# Altium schematic sheet 24V_Power_Supply.SchDoc: STM32F412 CNC
size B; Author: AM; CompanyName: Expatria Technologies; DrawnBy: A.Marles; Engineer: AM; Organization: Expatria Technolgoies; Address1: PO Box 2084; Address3: Merritt, BC V1K 1B8; Address4: Canada; DocumentNumber: 20; SheetNumber: 21; SheetTotal: 27
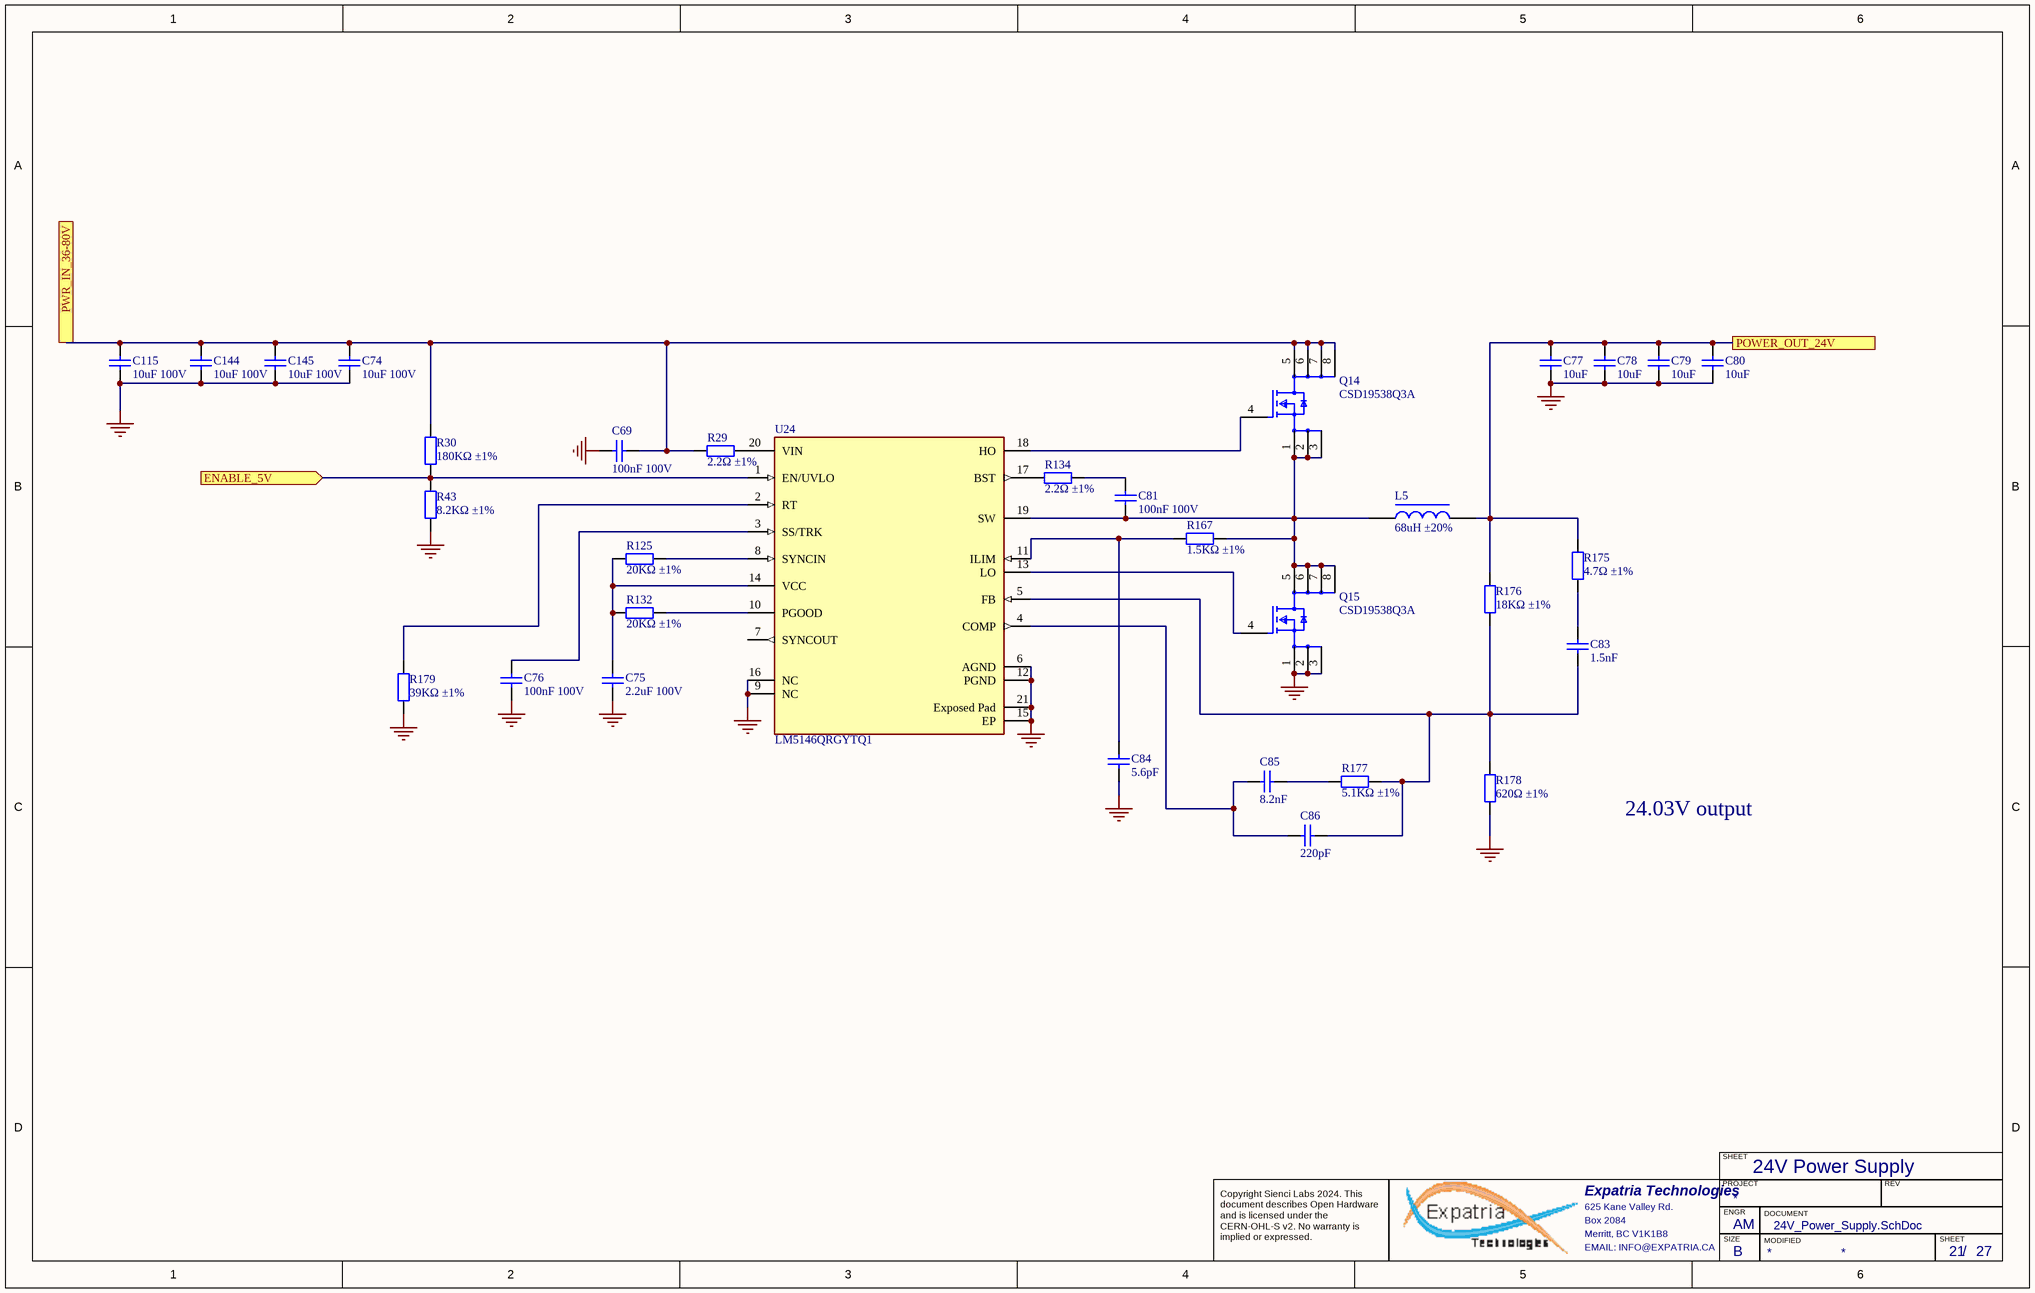
[diagram p0: 24V_Power_Supply.SchDoc]

## Parts
C69  100nF 100V  [0805_C]
C74  10uF 100V  [1210_C]
C75  2.2uF 100V  [1206_C]
C76  100nF 100V  [0805_C]
C77  10uF  [1206_C]
C78  10uF  [1206_C]
C79  10uF  [1206_C]
C80  10uF  [1206_C]
C81  100nF 100V  [0805_C]
C83  1.5nF  [0603_C]
C84  5.6pF  [0603_C]
C85  8.2nF  [0603_C]
C86  220pF  [0603_C]
C115  10uF 100V  [1210_C]
C144  10uF 100V  [1210_C]
C145  10uF 100V  [1210_C]
L5  68uH ±20%  [INDP126126X68N]
Q14  CSD19538Q3A  [FP-DNH0008A-MFG]
Q15  CSD19538Q3A  [FP-DNH0008A-MFG]
R29  2.2Ω ±1%  [0603_R]
R30  180KΩ ±1%  [0603_R]
R43  8.2KΩ ±1%  [0603_R]
R125  20KΩ ±1%  [0603_R]
R132  20KΩ ±1%  [0603_R]
R134  2.2Ω ±1%  [0603_R]
R167  1.5KΩ ±1%  [0603_R]
R175  4.7Ω ±1%  [0603_R]
R176  18KΩ ±1%  [0603_R]
R177  5.1KΩ ±1%  [0603_R]
R178  620Ω ±1%  [0603_R]
R179  39KΩ ±1%  [0603_R]
U24  LM5146QRGYTQ1  [FP-RGY0020B-MFG]

## Ports
ENABLE_5V (in), POWER_OUT_24V, PWR_IN_36-80V

## Nets
GND: C69.1 C74.1 C75.1 C76.1 C77.1 C78.1 C79.1 C80.1 C84.1 C115.1 C144.1 C145.1 Q15.1(S) Q15.2(S) Q15.3(S) R43.1 R178.1 R179.1 U24.6(AGND) U24.9(NC) U24.12(PGND) U24.15(EP) U24.16(NC) U24.21(Exposed_Pad)
ENABLE_5V: R30.1 R43.2 U24.1(EN/UVLO) ; port ENABLE_5V
POWER_OUT_24V: C77.2 C78.2 C79.2 C80.2 L5.2 R175.1 R176.2 ; port POWER_OUT_24V
PWR_IN_36-80V: C69.2 C74.2 C115.2 C144.2 C145.2 Q14.5(D) Q14.6(D) Q14.7(D) Q14.8(D) R29.1 R30.2 ; port PWR_IN_36-80V
NetC75_2: C75.2 R125.1 R132.1 U24.14(VCC)
NetC76_2: C76.2 U24.3(SS/TRK)
NetC81_1: C81.1 L5.1 Q14.1(S) Q14.2(S) Q14.3(S) Q15.5(D) Q15.6(D) Q15.7(D) Q15.8(D) R167.2 U24.19(SW)
NetC81_2: C81.2 R134.2
NetC83_1: C83.1 C86.2 R176.1 R177.2 R178.2 U24.5(FB)
NetC83_2: C83.2 R175.2
NetC84_2: C84.2 R167.1 U24.11(ILIM)
NetC85_1: C85.1 C86.1 U24.4(COMP)
NetC85_2: C85.2 R177.1
NetQ14_4: Q14.4(G) U24.18(HO)
NetQ15_4: Q15.4(G) U24.13(LO)
NetR29_2: R29.2 U24.20(VIN)
NetR125_2: R125.2 U24.8(SYNCIN)
NetR132_2: R132.2 U24.10(PGOOD)
NetR134_1: R134.1 U24.17(BST)
NetR179_2: R179.2 U24.2(RT)

Not connected (* = marked no-connect by the designer): U24 7(SYNCOUT)

## Notes on the sheet
- 24.03V output
- 24V Power Supply
- SHEET
- Expatria Technologies
- 625 Kane Valley Rd.
- Box 2084
- Merritt, BC V1K1B8
- PROJECT
- SIZE
- ENGR
- MODIFIED
- DOCUMENT
- REV
- Copyright Sienci Labs 2024. This document describes Open Hardware and is licensed under the CERN-OHL-S v2. No warranty is implied or expressed.
- EMAIL: INFO@EXPATRIA.CA
- B
- /

## Library data of the parts
C69 C76 C81 = 0805 100nF (683) 10% 100V: Chip capacitors; Manufacturer: Guangdong Fenghua Advanced Tech; Manufacturer Part Number: 0805B104K101NT; Tolerance: 10%; ComponentLink1Description: Supplier link; ComponentLink1URL: http://www.szlcsc.com/product/details_2108.html; Package: 0805; Supplier: LC; SuppliersPartNumber: C89258; Capacitance: 100nF; Voltage: 100V
C74 C115 C144 C145 = 1210 10uF (106) 10% 100V: Chip capacitors; Manufacturer: Murata; Manufacturer Part Number: GRM32EC72A106KE05L; Tolerance: 10%; Package: 1210; Supplier: LC; SuppliersPartNumber: C576517; Capacitance: 10uF; Voltage: 100V
C75 = 1206 2.2uF (225) 10% 50V: Chip capacitors; Manufacturer: Samsung Electro-Mechanics; Manufacturer Part Number: CL31A225KBHNNNE; Tolerance: 10%; ComponentLink1Description: Supplier link; ComponentLink1URL: http://www.szlcsc.com/product/details_13292.html; Package: 1206; Supplier: LC; SuppliersPartNumber: C170101; Capacitance: 2.2uF; Voltage: 100V
C77-C80 = 1206 10uF (106) 10% 50V: 50V 10uF X5R ±10% 1206 Multilayer Ceramic Capacitors MLCC - SMD/SMT ROHS; Manufacturer: Samsung Electro-Mechanics; Manufacturer Part Number: CL31A106KBHNNNE; Package: 1206; Supplier: LC; SuppliersPartNumber: C13585; Capacitance: 10uF; Tolerance: 10%; Voltage: 50V
C83 = 0603 1.5nF (152) 10% 50V: Chip capacitors; Manufacturer: Guangdong Fenghua Advanced Tech; Manufacturer Part Number: 0603B152K500NT; Tolerance: 10%; Voltage: 50V; ComponentLink1Description: Supplier link; ComponentLink1URL: http://www.szlcsc.com/product/details_1947.html; Package: 0603; Supplier: LC; SuppliersPartNumber: C1595; Capacitance: 1.5nF
C84 = 0603 4.7pF (4R7) 0.25pF 50V: Chip capacitors; Manufacturer: Murata; Manufacturer Part Number: GQM1875C2E5R6BB12D; Tolerance: 0.25pF; Voltage: 250V; ComponentLink1Description: Supplier link; ComponentLink1URL: http://www.szlcsc.com/product/details_2021.html; Package: 0603; Supplier: LC; SuppliersPartNumber: C2297617; Capacitance: 5.6pF
C85 = 0603 8.2nF (822) 10% 50V: 50V 8.2nF X7R ±10% 0603 Multilayer Ceramic Capacitors MLCC - SMD/SMT ROHS; Manufacturer: YAGEO; Manufacturer Part Number 1: CC0603KRX7R9BB822; Package: 0603; Supplier: LC; SuppliersPartNumber: C113812; Capacitance: 8.2nF; Tolerance: 10%; Voltage: 50V; Manufacturer 1: YAGEO; Value: 8.2nF; Manufacturer Part Number: CC0603KRX7R9BB822
C86 = 0603 220pF (221) 10% 50V: Chip capacitors; Manufacturer: Samsung Electro-Mechanics; Manufacturer Part Number: CL10B221KB8NNNC; Tolerance: 10%; Voltage: 50V; ComponentLink1Description: Supplier link; ComponentLink1URL: http://www.szlcsc.com/product/details_1955.html; Package: 0603; Supplier: LC; SuppliersPartNumber: C1603; Capacitance: 220pF
L5 = 12.5x12.5x6.5 68uH 20% 3A: 3A 68uH ±20% 64.8mΩ SMD Inductors (SMD) ROHS; Manufacturer: hanxia; Manufacturer Part Number: HX CYH125-68UH; Package: SMD,12.5x12.5mm; Supplier: LC; SuppliersPartNumber: C7587712; Value: 68uH ±20%
Q14 Q15 = CSD19538Q3A: CSD19538Q3A 100-V, N channel NexFET™ power MOSFET, single SON 3 mm x 3 mm, 61 mOhm 8-VSONP -55 to 150; Manufacturer Lifecycle Status: ACTIVE; NexarPartId: 74208282; Manufacturer: Texas Instruments; Drain to Source Voltage (Vdss): 100V; Number of Channels: 1; Power Dissipation: 2.8W; Continuous Drain Current (ID): 4.9A; Input Capacitance: 454pF; Turn-On Delay Time: 5ns; Rds On Max: 59mΩ; Gate to Source Voltage (Vgs): 20V; Max Junction Temperature (Tj): 150°C; Turn-Off Delay Time: 7ns; Drain to Source Resistance: 49mΩ; Mount: Surface Mount; Min Operating Temperature: -55°C; Lead Free: Lead Free; Width: 3.3mm; Length: 3.3mm; Lifecycle Status: Production; Schedule B: 8541290080, 8541290080; RoHS: Compliant; Max Operating Temperature: 150°C; Height: 900µm; Drain to Source Breakdown Voltage: 100V; Element Configuration: Single; Number of Pins: 8; Thickness: 800µm; Max Power Dissipation: 2.8W; SuppliersPartNumber: C478471; Manufacturer Part Number 1: CSD19538Q3A; Manufacturer Part Number: CSD19538Q3A
R29 R134 = 0603 2.2R (2R20) 1%: Chip resistor; Manufacturer: Uniroyal Elec; Manufacturer Part Number: 0603WAF220KT5E; Power: 1/10W; ComponentLink1Description: Supplier link; ComponentLink1URL: http://www.szlcsc.com/product/details_23666.html; Package: 0603; Supplier: LC; SuppliersPartNumber: C22939; Resistance: 2.2Ω; Tolerance: 1%
R30 = 0603 180K (1803) 1%: Chip resistor; Manufacturer: Uniroyal Elec; Manufacturer Part Number: 0603WAF1803T5E; Power: 1/10W; ComponentLink1Description: Supplier link; ComponentLink1URL: http://www.szlcsc.com/product/details_23554.html; Package: 0603; Supplier: LC; SuppliersPartNumber: C22827; Resistance: 180KΩ; Tolerance: 1%
R43 = 0603 8.2K (8201) 1%: Chip resistor; Manufacturer: Uniroyal Elec; Manufacturer Part Number: 0603WAF8201T5E; Power: 1/10W; ComponentLink1Description: Supplier link; ComponentLink1URL: http://www.szlcsc.com/product/details_26724.html; Package: 0603; Supplier: LC; SuppliersPartNumber: C25981; Resistance: 8.2KΩ; Tolerance: 1%
R125 R132 = 0603 20K (2002) 1%: Chip resistor; Manufacturer: Uniroyal Elec; Manufacturer Part Number: 0603WAF2002T5E; Power: 1/10W; ComponentLink1Description: Supplier link; ComponentLink1URL: http://www.szlcsc.com/product/details_4591.html; Package: 0603; Supplier: LC; SuppliersPartNumber: C4184; Resistance: 20KΩ; Tolerance: 1%
R167 = 0603 1.5K (1501) 1%: Chip resistor; Manufacturer: Uniroyal Elec; Manufacturer Part Number: 0603WAF1501T5E; Power: 1/10W; ComponentLink1Description: Supplier link; ComponentLink1URL: http://www.szlcsc.com/product/details_23570.html; Package: 0603; Supplier: LC; SuppliersPartNumber: C22843; Resistance: 1.5KΩ; Tolerance: 1%
R175 = 0603 4.7R (4R70) 1%: Chip resistor; Manufacturer: Uniroyal Elec; Manufacturer Part Number: 0603WAF470KT5E; Power: 1/10W; ComponentLink1Description: Supplier link; ComponentLink1URL: http://www.szlcsc.com/product/details_23891.html; Package: 0603; Supplier: LC; SuppliersPartNumber: C23164; Resistance: 4.7Ω; Tolerance: 1%
R176 = 0603 18K (1802) 1%: Chip resistor; Manufacturer: Uniroyal Elec; Manufacturer Part Number: 0603WAF1802T5E; Power: 1/10W; ComponentLink1Description: Supplier link; ComponentLink1URL: http://www.szlcsc.com/product/details_26553.html; Package: 0603; Supplier: LC; SuppliersPartNumber: C25810; Resistance: 18KΩ; Tolerance: 1%
R177 = 0603 5.1K (5101) 1%: Chip resistor; Manufacturer: Uniroyal Elec; Manufacturer Part Number: 0603WAF5101T5E; Power: 1/10W; ComponentLink1Description: Supplier link; ComponentLink1URL: http://www.szlcsc.com/product/details_23913.html; Package: 0603; Supplier: LC; SuppliersPartNumber: C23186; Resistance: 5.1KΩ; Tolerance: 1%
R178 = 0603 620R (6200) 1%: Chip resistor; Manufacturer: Uniroyal Elec; Manufacturer Part Number: 0603WAF6200T5E; Power: 1/10W; ComponentLink1Description: Supplier link; ComponentLink1URL: http://www.szlcsc.com/product/details_23947.html; Package: 0603; Supplier: LC; SuppliersPartNumber: C23220; Resistance: 620Ω; Tolerance: 1%
R179 = 0603 39K (3902) 1%: Chip resistor; Manufacturer: Uniroyal Elec; Manufacturer Part Number: 0603WAF3902T5E; Power: 1/10W; ComponentLink1Description: Supplier link; ComponentLink1URL: http://www.szlcsc.com/product/details_23880.html; Package: 0603; Supplier: LC; SuppliersPartNumber: C23153; Resistance: 39KΩ; Tolerance: 1%
U24 = LM5146QRGYTQ1: Automotive 100-V synchronous buck DC/DC controller with wide duty-cycle range 20-VQFN -40 to 150; Manufacturer 1: Texas Instruments; RoHS Compliant: Yes; SuppliersPartNumber: C3188679; Manufacturer Part Number 1: LM5146QRGYTQ1; Supplier 1: LCSC; Supplier Part Number 1: C2876733; Manufacturer: Texas Instruments; Manufacturer Part Number: LM5146QRGYTQ1; RoHS: Yes; Category: Voltage Regulators - Switching; Stock 1: 6; Pricing 1: 1=4.6067, 10=4.4193, 30=4.0941, 100=3.8099 (USD); ComponentLink1URL: http://www.ti.com/general/docs/suppproductinfo.tsp?distId=10&amp;gotoUrl=http%3A%2F%2Fwww.ti.com%2Flit%2Fgpn%2Flm5146-q1&src-supplier=Digikey; ComponentLink1Description: http://www.ti.com/general/docs/suppproductinfo.tsp?distId=10&amp;gotoUrl=http%3A%2F%2Fwww.ti.com%2Flit%2Fgpn%2Flm5146-q1&src-supplier=Digikey